# EAGLE design bj123123LCD (EAGLE 7.7.0)
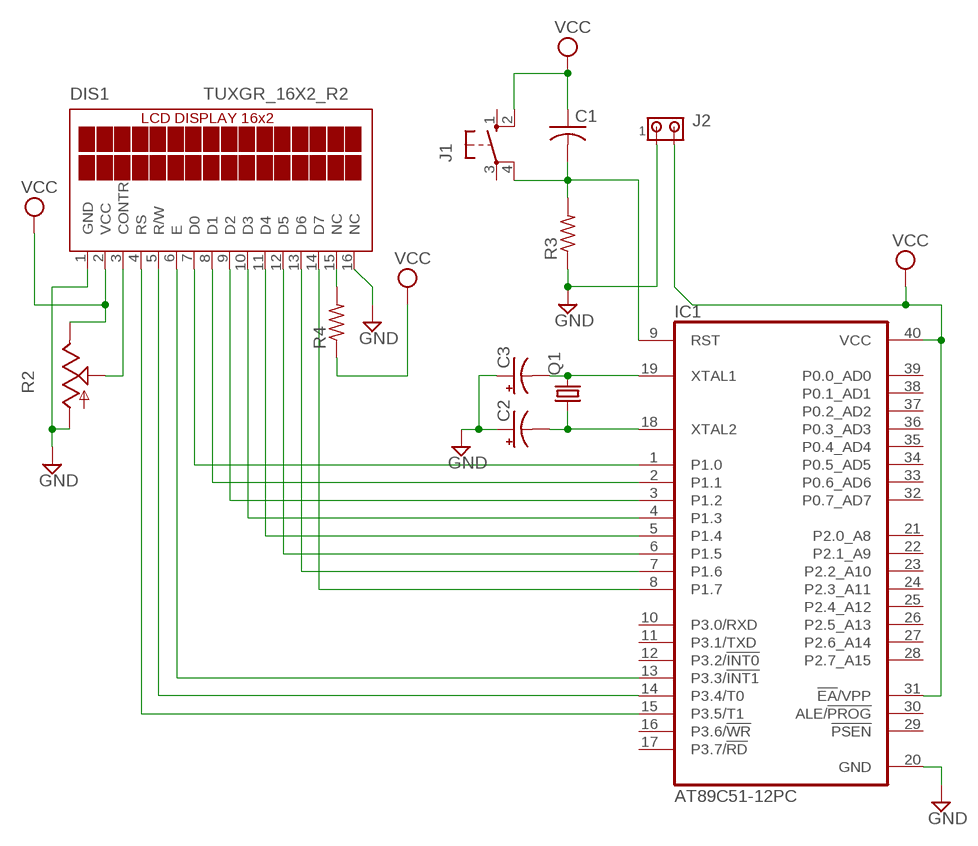
[diagram p0: schematic, sheet 1]

## Parts
C1  C-US025-025X050  [C025-025X050]
C2  CPOL-USE2.5-5  [E2,5-5]
C3  CPOL-USE2.5-5  [E2,5-5]
DIS1  TUXGR_16X2_R2  [TUXGR_16X2_R2]
IC1  AT89C51-12PC  [DIL40]
J1  10-XX  [B3F-10XX]
J2  MTA02-100  [10X02MTA]
Q1  CRYSTALTC26H  [TC26H]
R2  TRIM_US-B25U  [B25U]
R3  R-US_R2512  [R2512]
R4  R-US_R2512  [R2512]

## Nets
GND: C2.+ C3.+ DIS1.1(GND) DIS1.16(NC) IC1.20(GND) J2.1 R2.A R3.1
N$1: DIS1.7(D0) IC1.1(P1.0)
N$2: DIS1.8(D1) IC1.2(P1.1)
N$3: DIS1.9(D2) IC1.3(P1.2)
N$4: DIS1.10(D3) IC1.4(P1.3)
N$5: DIS1.11(D4) IC1.5(P1.4)
N$6: DIS1.12(D5) IC1.6(P1.5)
N$7: DIS1.13(D6) IC1.7(P1.6)
N$8: DIS1.14(D7) IC1.8(P1.7)
N$9: DIS1.15(NC) R4.2
N$10: C3.- IC1.19(XTAL1) Q1.2
N$11: C1.2 IC1.9(RST) J1.4(P1) R3.2
N$12: C2.- IC1.18(XTAL2) Q1.1
N$13: DIS1.6(E) IC1.13(P3.3/!INT1)
N$14: DIS1.5(R/W) IC1.14(P3.4/T0)
N$15: DIS1.3(CONTR) R2.S
N$17: DIS1.4(RS) IC1.15(P3.5/T1)
VCC: C1.1 DIS1.2(VCC) IC1.31(!EA!/VPP) IC1.40(VCC) J1.2(S1) J2.2 R2.E R4.1
Unconnected: IC1.10(P3.0/RXD) IC1.11(P3.1/TXD) IC1.12(P3.2/!INT0) IC1.16(P3.6/!WR) IC1.17(P3.7/!RD) IC1.21(P2.0_A8) IC1.22(P2.1_A9) IC1.23(P2.2_A10) IC1.24(P2.3_A11) IC1.25(P2.4_A12) IC1.26(P2.5_A13) IC1.27(P2.6_A14) IC1.28(P2.7_A15) IC1.29(!PSEN) IC1.30(ALE/!PROG) IC1.32(P0.7_AD7) IC1.33(P0.6_AD6) IC1.34(P0.5_AD5) IC1.35(P0.4_AD4) IC1.36(P0.3_AD3) IC1.37(P0.2_AD2) IC1.38(P0.1_AD1) IC1.39(P0.0_AD0) J1.1(S) J1.3(P)

## Library data of the parts
C1 = rcl:C-US: CAPACITOR, American symbol
C2 C3 = rcl:CPOL-US: POLARIZED CAPACITOR, American symbol
DIS1 = display-lcd:TUXGR_16X2_R2: Tuxgraphics LCD display 16x2 characters reflective, without background light Source: tuxgr_12x2_r2.pdf; OC_FARNELL: unknown; OC_NEWARK: unknown
IC1 = atmel:AT89C51-*: 8-bit Microcontroller with 4K Bytes Flash Not Recommended for New Designs. Use AT89S51. Source: http://www.atmel.com/dyn/resources/prod_documents/doc0265.; OC_FARNELL: unknown; OC_NEWARK: unknown
J1 = switch-omron:10-XX: OMRON SWITCH; MPN: B3F-1000; OC_FARNELL: 176432; OC_NEWARK: 36M3542
J2 = con-amp:MTA02-100: AMP connector
Q1 = crystal:CRYSTAL: CRYSTAL; OC_FARNELL: unknown; OC_NEWARK: unknown
R2 = pot:TRIM_US-: POTENTIOMETER
R3 R4 = rcl:R-US_: RESISTOR, American symbol

## Board
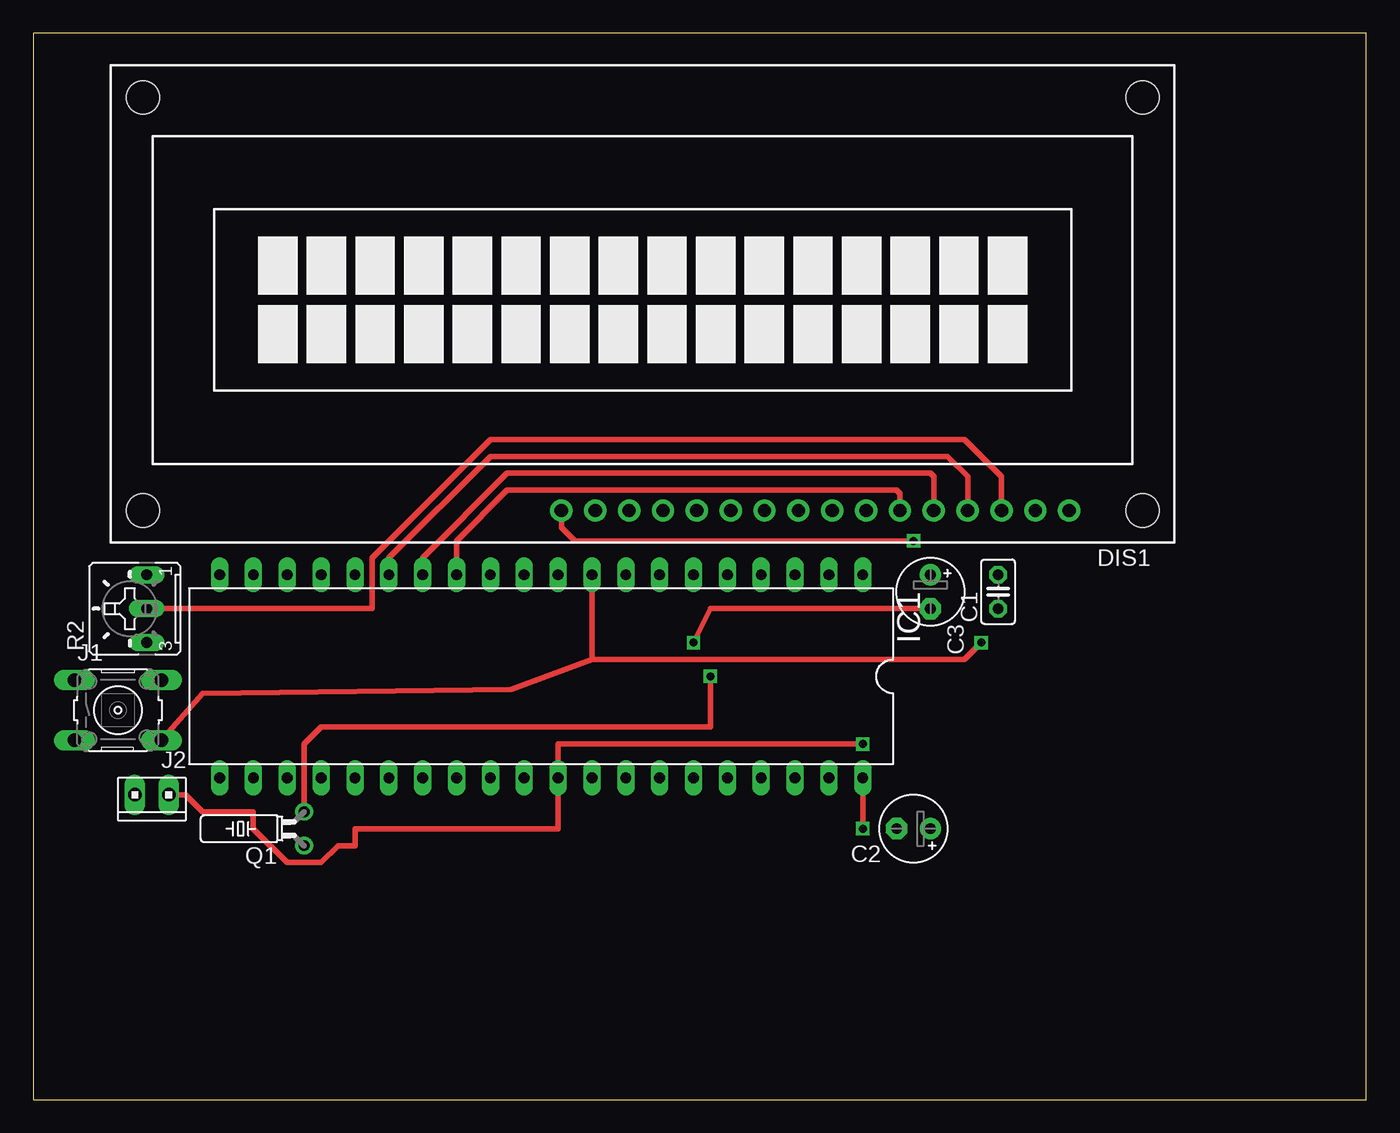
[diagram p1: board, top side]
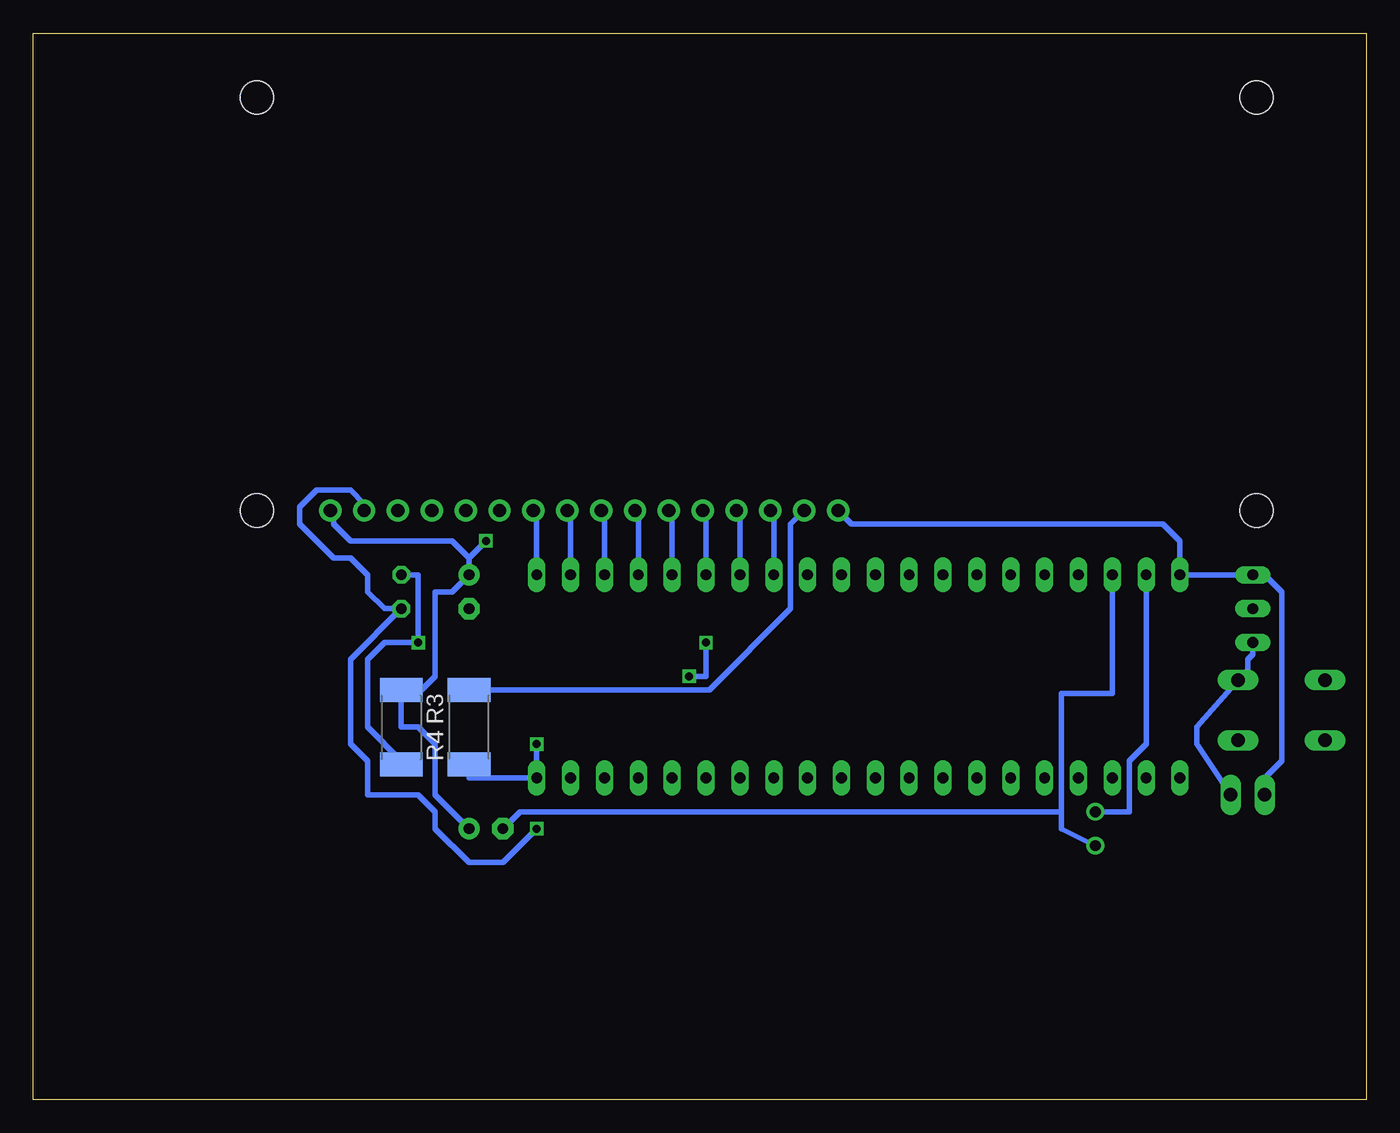
[diagram p2: board, bottom side, seen from below]

Size 100 x 80 mm. Coordinates in mm from the lower left corner, seen from the top.
Outline: 0,0 100,0 100,80 0,80 0,0
Copper layers (1*16): Top 0.035mm / dielectric 1.5mm / Bottom 0.035mm
Design rules "default": minimum track width 10mil, minimum drill 24mil, track to track 8mil, track to pad 8mil, pad to pad 8mil, via to via 8mil, smd to smd 8mil, copper to edge 40mil, drill to drill 8mil, minimum pad ring 10mil, minimum via ring 8mil, stop-mask expansion 4mil, vias tented up to drill 0mil, thermal gap 10mil

### Footprints (pad centres in the part's own frame; a part is rotated, then mirrored left to right if it is on the bottom)
C025-025X050 = drill 0.813 octagon: 1 -1.27,0; 2 1.27,0
E2,5-5 = drill 0.813 pad 1.6: + -1.27,0 | drill 0.813 pad 1.6 octagon: - 1.27,0
TUXGR_16X2_R2 = drill 1 pad 1.676: 1 -32,15.5; 2 -29.46,15.5; 3 -26.92,15.5; 4 -24.38,15.5; 5 -21.84,15.5; 6 -19.3,15.5; 7 -16.76,15.5; 8 -14.22,15.5; 9 -11.68,15.5; 10 -9.14,15.5; 11 -6.6,15.5; 12 -4.06,15.5; 13 -1.52,15.5; 14 1.02,15.5; 15 3.56,15.5; 16 6.1,15.5 | hole 2.5: -37.5,-15.5; 37.5,-15.5; -37.5,15.5; 37.5,15.5
DIL40 = drill 0.813 long: 1 -24.13,-7.62; 2 -21.59,-7.62; 3 -19.05,-7.62; 4 -16.51,-7.62; 5 -13.97,-7.62; 6 -11.43,-7.62; 7 -8.89,-7.62; 8 -6.35,-7.62; 9 -3.81,-7.62; 10 -1.27,-7.62; 11 1.27,-7.62; 12 3.81,-7.62; 13 6.35,-7.62; 14 8.89,-7.62; 15 11.43,-7.62; 16 13.97,-7.62; 17 16.51,-7.62; 18 19.05,-7.62; 19 21.59,-7.62; 20 24.13,-7.62; 21 24.13,7.62; 22 21.59,7.62; 23 19.05,7.62; 24 16.51,7.62; 25 13.97,7.62; 26 11.43,7.62; 27 8.89,7.62; 28 6.35,7.62; 29 3.81,7.62; 30 1.27,7.62; 31 -1.27,7.62; 32 -3.81,7.62; 33 -6.35,7.62; 34 -8.89,7.62; 35 -11.43,7.62; 36 -13.97,7.62; 37 -16.51,7.62; 38 -19.05,7.62; 39 -21.59,7.62; 40 -24.13,7.62
B3F-10XX = drill 1.016 long: 1 -3.251,2.261; 2 3.251,2.261; 3 -3.251,-2.261; 4 3.251,-2.261
10X02MTA = drill 1.016 long: 1 1.27,0; 2 -1.27,0
TC26H = drill 0.813: 1 -1.27,0; 2 1.27,0
B25U = drill 0.813 long: A 2.54,-0.889; E -2.54,-0.889; S 0,-0.889
R2512 = smd 1.8 x 3.2: 1 -2.8,0; 2 2.8,0

### Placement (x,y rotation side)
C1  72.39,38.1 90 top
C2  66.04,20.32 180 top
C3  67.31,38.1 270 top
DIS1  45.72,59.69 180 top
IC1  38.1,31.75 180 top
J1  6.35,29.21 0 top
J2  8.89,22.86 180 top
Q1  20.32,20.32 90 top
R2  7.62,36.83 90 top
R3  72.39,27.94 270 bottom
R4  67.31,27.94 90 bottom

### Tracks (layer width: path | path; a pad name or v marks a point on that pad's centre or on a via)
GND  (via drill 0.6)
  Top 0.406: DIS1.16 39.62,42.93 40.64,41.91 v66.04,41.91
  Bottom 0.406: 67.31,40.64 C3.+ 68.58,38.1 69.85,38.1 69.85,31.75 70.86,30.74 R3.1 72.39,27.94 71.12,27.94 69.85,26.67 69.85,22.86 C2.+ | 67.31,40.64 68.58,41.91 76.2,41.91 77.47,43.18 77.47,43.94 DIS1.1 | J2.1 7.62,24.13 6.35,25.4 6.35,38.1 7.62,39.37 R2.A IC1.20 13.97,41.91 15.24,43.18 38.61,43.18 DIS1.16 | 67.31,40.64 v66.04,41.91
N$1
  Bottom 0.406: DIS1.7 62.23,44.19 IC1.1
N$2
  Bottom 0.406: DIS1.8 59.69,44.19 IC1.2
N$3
  Bottom 0.406: DIS1.9 57.15,44.19 IC1.3
N$4
  Bottom 0.406: DIS1.10 54.61,44.19 IC1.4
N$5
  Bottom 0.406: DIS1.11 52.07,44.19 IC1.5
N$6
  Bottom 0.406: DIS1.12 49.53,44.19 IC1.6
N$7
  Bottom 0.406: DIS1.13 46.99,44.19 IC1.7
N$8
  Bottom 0.406: DIS1.14 44.45,44.19 IC1.8
N$9
  Bottom 0.406: R4.2 49.27,30.74 43.18,36.83 43.18,43.17 DIS1.15
N$10  (via drill 0.6)
  Top 0.406: C3.- 50.8,36.83 v49.53,34.29 | Q1.2 20.32,26.67 21.59,27.94 50.8,27.94 v50.8,31.75
  Bottom 0.406: IC1.19 16.51,26.67 17.78,25.4 17.78,21.59 Q1.2 | v49.53,34.29 49.53,31.75 v50.8,31.75
N$11  (via drill 0.6)
  Top 0.406: 41.91,33.02 35.84,30.76 12.7,30.48 J1.4 | IC1.9 41.91,33.02 | 41.91,33.02 69.85,33.02 v71.12,34.29
  Bottom 0.406: R3.2 72.39,25.4 74.93,27.94 74.93,33.02 73.66,34.29 v71.12,34.29 71.12,39.37 C1.2
N$12
  Bottom 0.406: IC1.18 19.05,30.48 22.86,30.48 22.86,21.59 | 22.86,21.59 22.86,20.32 Q1.1 | C2.- 63.5,21.59 22.86,21.59
N$13
  Top 0.406: DIS1.6 65.02,45.47 64.77,45.72 35.56,45.72 31.75,41.91 IC1.13
N$14
  Top 0.406: DIS1.5 67.56,46.74 67.31,46.99 35.56,46.99 29.21,40.64 IC1.14
N$15
  Top 0.406: DIS1.3 72.64,46.74 69.85,49.53 34.29,49.53 25.4,40.64 25.4,36.83 R2.S
N$17
  Top 0.406: DIS1.4 70.1,46.74 68.58,48.26 34.29,48.26 26.67,40.64 IC1.15
VCC  (via drill 0.6)
  Top 0.406: v62.23,26.67 39.37,26.67 IC1.31 39.37,20.32 24.13,20.32 24.13,19.05 22.86,19.05 21.59,17.78 19.05,17.78 16.51,20.32 16.51,21.59 12.7,21.59 11.43,22.86 J2.2 | IC1.40 v62.23,20.32
  Bottom 0.406: DIS1.2 75.18,44.7 76.2,45.72 78.74,45.72 80.01,44.45 80.01,43.18 77.47,40.64 76.2,40.64 74.93,39.37 74.93,38.1 73.66,36.83 C1.1 76.2,33.02 76.2,26.67 74.93,25.4 74.93,22.86 71.12,22.86 69.85,21.59 69.85,20.32 67.31,17.78 64.77,17.78 v62.23,20.32 | R2.E 8.51,33.4 8.89,33.02 8.89,32.18 J1.2 12.7,27.94 12.7,26.67 J2.2 | R4.1 67.31,24.13 IC1.40 v62.23,26.67